# Altium schematic sheet lab2_kuchenov_buck.SchDoc: =title_line_1 + title_line_2
size 594 x 420 mm; SheetNumber: n
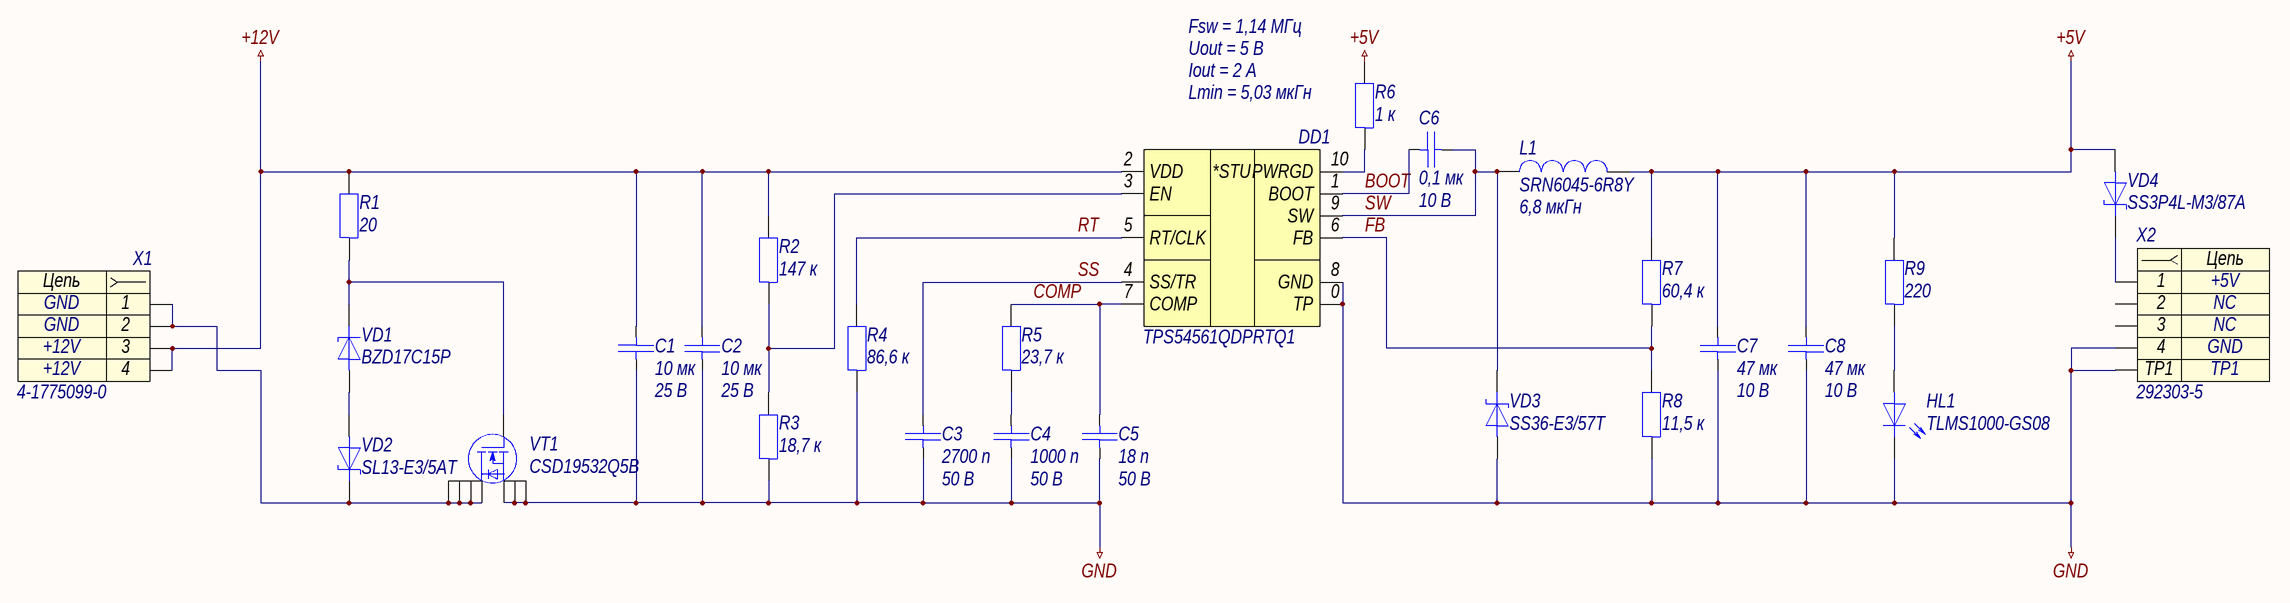
[diagram p0: lab2_kuchenov_buck.SchDoc]

## Parts
C1  10 мк  Напряжение: 25 В  [C0805]
C2  10 мк  Напряжение: 25 В  [C0805]
C3  2700 п  Напряжение: 50 В  [C0805]
C4  1000 п  Напряжение: 50 В  [C0402]
C5  18 п  Напряжение: 50 В  [C0805]
C6  0,1 мк  Напряжение: 10 В  [C0402]
C7  47 мк  Напряжение: 10 В  [C1210]
C8  47 мк  Напряжение: 10 В  [C1210]
DD1  TPS54561QDPRTQ1  [WSON-10-400X400X80]
HL1  TLMS1000-GS08  [HL0603]
L1  SRN6045-6R8Y  Индуктивность: 6,8 мкГн  [SRN-2-600X600X450]
R1  20  [R0402]
R2  147 к  [R0603]
R3  18,7 к  [R0402]
R4  86,6 к  [R0201]
R5  23,7 к  [R0201]
R6  1 к  [R0402]
R7  60,4 к  [R0402]
R8  11,5 к  [R0402]
R9  220  [R0603]
VD1  BZD17C15P  [DO-219AB]
VD2  SL13-E3/5AT  [DO-214AC]
VD3  SS36-E3/57T  [DO-214AB]
VD4  SS3P4L-M3/87A  [TO-277A]
VT1  CSD19532Q5B  [SON-8]
X1  4-1775099-0  [4-1775099-0]
X2  292303-5  [292303-5]

## Nets
+5V: C7.1 C8.1 L1.2 R6.2 R7.2 R9.2 VD4.2
+12V: C1.2 C2.1 DD1.2(VDD) R1.2 R2.2 X1.3 X1.4
GND: C1.1 C2.2 C3.2 C4.2 C5.2 C7.2 C8.2 DD1.0(TP) DD1.8(GND) HL1.1 R3.1 R4.1 R8.1 VD3.2 VT1.S X2.4 X2.TP1
BOOT: C6.2 DD1.1(BOOT)
COMP: C5.1 DD1.7(COMP) R5.2
FB: DD1.6(FB) R7.1 R8.2
RT: DD1.5(RT/CLK) R4.2
SS: C3.1 DD1.4(SS/TR)
SW: C6.1 DD1.9(SW) L1.1 VD3.1
NetC4_1: C4.1 R5.1
NetDD1_3: DD1.3(EN) R2.1 R3.2
NetDD1_10: DD1.10(PWRGD) R6.1
NetHL1_2: HL1.2 R9.1
NetR1_1: R1.1 VD1.1 VT1.G
NetVD1_2: VD1.2 VD2.2
NetVD2_1: VD2.1 VT1.D X1.1 X1.2
NetVD4_1: VD4.1 X2.1

Not connected (* = marked no-connect by the designer): X2 2 3

## Notes on the sheet
- Fsw = 1,14 МГц
- Uout = 5 В
- Iout = 2 А
- (near R6) Lmin = 5,03 мкГн
- Перв. примен.
- Справ. №
- Подп. и дата
- Инв. № дубл.
- Нормоконтроль:
- Взам. инв. №
- Изм.
- Лист
- № докум.
- Подп.
- Дата
- Лит.
- Масса
- Масштаб
- Т.контр.
- Пров.
- Разраб.
- Листов
- Разработал:
- Инв. № подл.
- Н.контр.
- Утв.
- Копировал
- Формат
- А2
- (in symbol dd0015) *STU
- (in symbol x0003) Цепь
- (in symbol x0004) Цепь

## Library data of the parts
C1 C2 = c0119: =Описание; ID: c0119; Фамилия: Кученов; Описание: Конденсатор чип 0805 10 мкФ 25 В ±20 %; Наименование: GRM21BR61E106MA73L; Производитель: Murata Manufacturing Co., Ltd.; Отклонение: ±20 %; Рабочие температуры: от –55 °С до +85 °С; Температурный коэффициент емкости: X5R; Корпус: 0805; Номинал: 10 мк; Номинальное напряжение: 25 В; HelpURL: https://search.murata.co.jp/Ceramy/image/img/A01X/G101/ENG/GRM21BR61E106MA73-01.pdf
C3 = c0120: =Описание; ID: c0120; Фамилия: Кученов; Описание: Конденсатор чип 0805 2,7 нФ 50 В ±5 %; Наименование: C2012C0G1H272J060AA; Производитель: TDK Corporation; Отклонение: ±5 %; Рабочие температуры: от –55 °С до +125 °С; Температурный коэффициент емкости: C0G; Корпус: 0805; Номинал: 2700 п; Номинальное напряжение: 50 В; HelpURL: https://product.tdk.com/en/search/capacitor/ceramic/mlcc/info?part_no=C2012C0G1H272J060AA
C4 = c0121: =Описание; ID: c0121; Фамилия: Кученов; Описание: Конденсатор чип 0402 1 нФ 50 В ±5 %; Наименование: GRM1555C1H102JA01J; Производитель: Murata Manufacturing Co., Ltd.; Отклонение: ±5 %; Рабочие температуры: от –55 °С до +125 °С; Температурный коэффициент емкости: C0G; Корпус: 0402; Номинал: 1000 п; Номинальное напряжение: 50 В; HelpURL: https://www.murata.com/en-eu/products/productdetail?partno=GRM1555C1H102JA01%23
C5 = c0122: =Описание; ID: c0122; Фамилия: Кученов; Описание: Конденсатор чип 0805 18 пФ 50 В ±5 %; Наименование: CL21C180JBANNNC; Производитель: Samsung electro-mechanics; Отклонение: ±5 %; Рабочие температуры: от –55 °С до +125 °С; Температурный коэффициент емкости: C0G; Корпус: 0805; Номинал: 18 п; Номинальное напряжение: 50 В; HelpURL: https://datasheet.lcsc.com/szlcsc/1810191212_Samsung-Electro-Mechanics-CL21C180JBANNNC_C170109.pdf
C6 = c0123: =Описание; ID: c0123; Фамилия: Кученов; Описание: Конденсатор чип 0402 100 нФ 10 В ±15 %; Наименование: GRM155R71A104KA01D; Производитель: Murata Manufacturing Co., Ltd.; Отклонение: ±15 %; Рабочие температуры: от –55 °С до +125 °С; Температурный коэффициент емкости: X7R; Корпус: 0402; Номинал: 0,1 мк; Номинальное напряжение: 10 В; HelpURL: https://www.murata.com/products/productdetail?partno=GRM155R71A104KA01%23
C7 C8 = c0124: =Описание; ID: c0124; Фамилия: Кученов; Описание: Конденсатор чип 1210 47 мкФ 10 В ±15 %; Наименование: GRM32ER71A476KE15; Производитель: Murata Manufacturing Co., Ltd.; Отклонение: ±15 %; Рабочие температуры: от –55 °С до +125 °С; Температурный коэффициент емкости: X7R; Корпус: 1210; Номинал: 47 мк; Номинальное напряжение: 10 В; HelpURL: https://www.murata.com/en-global/products/productdetail?partno=GRM32ER71A476KE15%23
DD1 = dd0015: =Описание; ID: dd0015; Фамилия: Кученов; Описание: Понижающий преобразователь напряжения 60 В и 5 А; Производитель: Texas Instruments; Входное напряжение: от 4,5 В до 60 В; Выходное напряжение: от 0,8 В до 59 В; Коммутируемый ток: до 5 А; Частота переключения: от 100 кГц до 2,5 МГц; Рабочие температуры: от –40 °С до +125 °С; Корпус: WSON-10; Наименование: TPS54561QDPRTQ1; HelpURL: https://www.ti.com/product/TPS54561-Q1
HL1 = hl0001: =Описание; ID: hl0001; Фамилия: Ларионов; Описание: Светодиод чип 0603 красный; Производитель: Vishay Intertechnology, Inc.; Цвет: Red; Номинальная сила света: 4 мкд; Номинальная длина волны: 628 нм; Номинальный прямой ток: 15 мА; Номинальное падение напряжения: 1,8 В; Рассеиваемая мощность: 40 мВт; Рабочие температуры: от –40 °С до +100 °С; Корпус: 0603; Наименование: TLMS1000-GS08; HelpURL: https://www.vishay.com/leds/list/product-83172/
L1 = l0006: =Описание; ID: l0006; Фамилия: Кученов; Описание: Катушка индуктивности 6,8 мкГн ±30 %; Производитель: Bourns, Inc.; Отклонение: ±30 %; Номинальное активное сопротивление: 47,3 мОм; Резонансная частота: 20 МГц; Номинальный ток (при нагреве на 20 °С/40 °С): 2,8 А; Ток насыщения: 3,8 А; Рабочее напряжение: не указано; Рабочие температуры: от –40 °С до +125 °С; Корпус: 6,0 x 6,0 x 4,5; Наименование: SRN6045-6R8Y; Номинал: 6,8 мкГн; Максимальное активное сопротивление: 47,3 мОм; HelpURL: https://www.bourns.com/products/magnetic-products/power-inductors-smd-semi-shielded/product/SRN6045
R1 = r0135: =Описание; ID: r0135; Фамилия: Кученов; Описание: Резистор чип 0402 20 Ом ±1 % 0,0625 Вт; Наименование: RC0402FR-0718K7L; Производитель: YAGEO Corp.; Отклонение: ±1 %; Номинальное напряжение: 50 В; Рабочие температуры: от –55 °С до +155 °С; Номинальный ток: 1 А; Корпус: 0402; Номинал: 20; HelpURL: https://www.yageo.com/upload/media/product/productsearch/datasheet/rchip/PYu-RC_Group_51_RoHS_L_11.pdf
R2 = r0100: =Описание; ID: r0100; Фамилия: Жернаков; Описание: Резистор чип 0603 147 кОм ±1 % 0,1 Вт; Наименование: RC0603FR-07147KL; Производитель: YAGEO Corp.; Отклонение: ±1 %; Номинальное напряжение: 75 В; Рабочие температуры: от –55 °С до +155 °С; Номинальный ток: 1 А; Корпус: 0603; Номинал: 147 к; HelpURL: https://www.yageo.com/upload/media/product/productsearch/datasheet/rchip/PYu-RC_Group_51_RoHS_L_11.pdf
R3 = r0134: =Описание; ID: r0134; Фамилия: Кученов; Описание: Резистор чип 0402 18,7 кОм ±1 % 0,0625 Вт; Наименование: RC0402FR-0718K7L; Производитель: YAGEO Corp.; Отклонение: ±1 %; Номинальное напряжение: 50 В; Рабочие температуры: от –55 °С до +155 °С; Номинальный ток: 1 А; Корпус: 0402; Номинал: 18,7 к; HelpURL: https://www.yageo.com/upload/media/product/productsearch/datasheet/rchip/PYu-RC_Group_51_RoHS_L_11.pdf
R4 = r0129: =Описание; ID: r0129; Фамилия: Кученов; Описание: Резистор чип 0201 86,6 кОм ±1 % 0,05 Вт; Наименование: RC0201FR-0786K6L; Производитель: YAGEO Corp.; Отклонение: ±1 %; Номинальное напряжение: 25 В; Рабочие температуры: от –55 °С до +125 °С; Номинальный ток: 0.5 А; Корпус: 0201; Номинал: 86,6 к; HelpURL: https://www.yageo.com/upload/media/product/productsearch/datasheet/rchip/PYu-RC_Group_51_RoHS_L_11.pdf
R5 = r0131: =Описание; ID: r0131; Фамилия: Кученов; Описание: Резистор чип 0201 23,7 кОм ±1 % 0,05 Вт; Наименование: RC0201FR-0723K7L; Производитель: YAGEO Corp.; Отклонение: ±1 %; Номинальное напряжение: 25 В; Рабочие температуры: от –55 °С до +125 °С; Номинальный ток: 0.5 А; Корпус: 0201; Номинал: 23,7 к; HelpURL: https://www.yageo.com/upload/media/product/productsearch/datasheet/rchip/PYu-RC_Group_51_RoHS_L_11.pdf
R6 = r0130: =Описание; ID: r0130; Фамилия: Кученов; Описание: Резистор чип 0402 1 кОм ±1 % 0,063 Вт; Наименование: CRCW04021K00FKED; Производитель: Vishay Intertechnology, Inc.; Отклонение: ±1 %; Номинальное напряжение: 50 В; Рабочие температуры: от –55 °С до +155 °С; Номинальный ток: 1.5 А; Корпус: 0402; Номинал: 1 к; HelpURL: https://www.vishay.com/docs/20035/dcrcwe3.pdf
R7 = r0132: =Описание; ID: r0132; Фамилия: Кученов; Описание: Резистор чип 0402 60,4 кОм ±1 % 0,063 Вт; Наименование: CRCW040260K4FKED; Производитель: Vishay Intertechnology, Inc.; Отклонение: ±1 %; Номинальное напряжение: 50 В; Рабочие температуры: от –55 °С до +155 °С; Номинальный ток: 1.5 А; Корпус: 0402; Номинал: 60,4 к; HelpURL: https://www.vishay.com/docs/20035/dcrcwe3.pdf
R8 = r0133: =Описание; ID: r0133; Фамилия: Кученов; Описание: Резистор чип 0402 11,5 кОм ±1 % 0,063 Вт; Наименование: CRCW040211K5FKED; Производитель: Vishay Intertechnology, Inc.; Отклонение: ±1 %; Номинальное напряжение: 50 В; Рабочие температуры: от –55 °С до +155 °С; Номинальный ток: 1.5 А; Корпус: 0402; Номинал: 11,5 к; HelpURL: https://www.vishay.com/docs/20035/dcrcwe3.pdf
R9 = r0009: =Описание; ID: r0009; Фамилия: Ларионов; Описание: Резистор чип 0603 220 Ом ±1 % 0,1 Вт; Наименование: RC0603FR-07220RL; Производитель: YAGEO Corp.; Отклонение: ±1 %; Номинальное напряжение: 75 В; Рабочие температуры: от -55 °С до +155 °С; Номинальный ток: 1 А; Корпус: 0603; Номинал: 220; HelpURL: https://www.yageo.com/upload/media/product/productsearch/datasheet/rchip/PYu-RC_Group_51_RoHS_L_11.pdf
VD1 = vd0016: =Описание; ID: vd0016; Фамилия: Жернаков; Описание: Стабилитрон 15 В; Производитель: Vishay Intertechnology, Inc.; Номинальное напряжение стабилизации: 15 В; Разброс напряжения стабилизации: 13,8...15,6 В; Номинальный ток стабилизации: 50 мА; Рабочие температуры: от –55 °С до +150 °С; Наименование: BZD17C15P; Корпус: DO-219AB; HelpURL: https://www.vishay.com/product?docid=85161
VD2 = vd0002: =Описание; ID: vd0002; Фамилия: Ларионов; Описание: Диод Шоттки 30 В 1,5 А; Производитель: Vishay Intertechnology, Inc.; Пиковое прямое напряжение: 0,445 В; Импульсное обратное напряжение: 30 В; Макс допустимый средний прямой ток: 1,5 А; Рабочие температуры: от –55 °С до +125 °С; Наименование: SL13-E3/5AT; Корпус: DO-214AC; HelpURL: https://www.vishay.com/product?docid=88740
VD3 = vd0004: =Описание; ID: vd0004; Фамилия: Жернаков; Описание: Диод Шоттки 60 В 3 А; Производитель: Vishay Intertechnology, Inc.; Пиковое прямое напряжение: 0,75 В; Импульсное обратное напряжение: 60 В; Макс допустимый средний прямой ток: 3 А; Рабочие температуры: от –55 °С до +150 °С; Наименование: SS36-E3/57T; Корпус: DO-214AB; HelpURL: https://www.vishay.com/product?docid=88751
VD4 = vd0003: =Описание; ID: vd0003; Фамилия: Ларионов; Описание: Диод Шоттки 40 В 3 А; Производитель: Vishay Intertechnology, Inc.; Пиковое прямое напряжение: 0,47 В; Импульсное обратное напряжение: 40 В; Макс допустимый средний прямой ток: 3 А; Рабочие температуры: от –55 °С до +150 °С; Наименование: SS3P4L-M3/87A; Корпус: TO-277A; HelpURL: https://www.vishay.com/diodes/list/product-88986/
VT1 = vt0001: =Описание; ID: vt0001; Фамилия: Жернаков; Описание: Транзистор полевой N-канальный 100 В 17 А; Производитель: Texas Instruments; Напряжение затвор — исток: ±20 В; Напряжение сток — исток: 100 В; Ток стока: 17 А; Сопротивление сток — исток: 0,0057 Ом; Рабочие температуры: от –55 °С до +150 °С; Наименование: CSD19532Q5B; Корпус: SON-8; HelpURL: https://www.ti.com/product/CSD19532Q5B
X1 = x0004: =Описание; Contact_1: GND; Contact_3: +12V; ID: x0004; Фамилия: Ларионов; Описание: ATX Power 4 pin гнездо прямой; Производитель: TE Connectivity; Contact_2: GND; Contact_4: +12V; Наименование: 4-1775099-0; HelpURL: https://www.te.com/usa-en/product-4-1775099-0.html
X2 = x0003: =Описание; Contact_1: +5V; Contact_2: NC; Contact_4: GND; ID: x0003; Фамилия: Ларионов; Описание: USB 2.0 Type A гнездо; Производитель: TE Connectivity; Contact_3: NC; Наименование: 292303-5; HelpURL: https://www.te.com/usa-en/product-292303-5.html